# Altium schematic sheet BalEv_ADC_v1_0.SchDoc
size A4; CompanyName: HESSO; Address1: Route du Rawyl 47; Address2: 1950 Sion; Address3: Switzerland; DocumentNumber: 3; SheetNumber: 5; SheetTotal: 8; PageSetup: Record=PageOptions|CenterHorizontal=True|CenterVertical=True|PrintScale=1.00|XCorrection=1.00|YCorrection=1.00|PrintKind=1|BorderSize=5000000|LeftOffset=0|BottomOffset=0|Orientation=2|PaperLength=1000|PaperWidth=1000|Scale=100|PaperSource=15|PrintQuality=1200|MediaType=1|DitherType=10|PrintScaleMode=1|PaperKind=A4|PaperIndex=9; ProjectName: Project Name
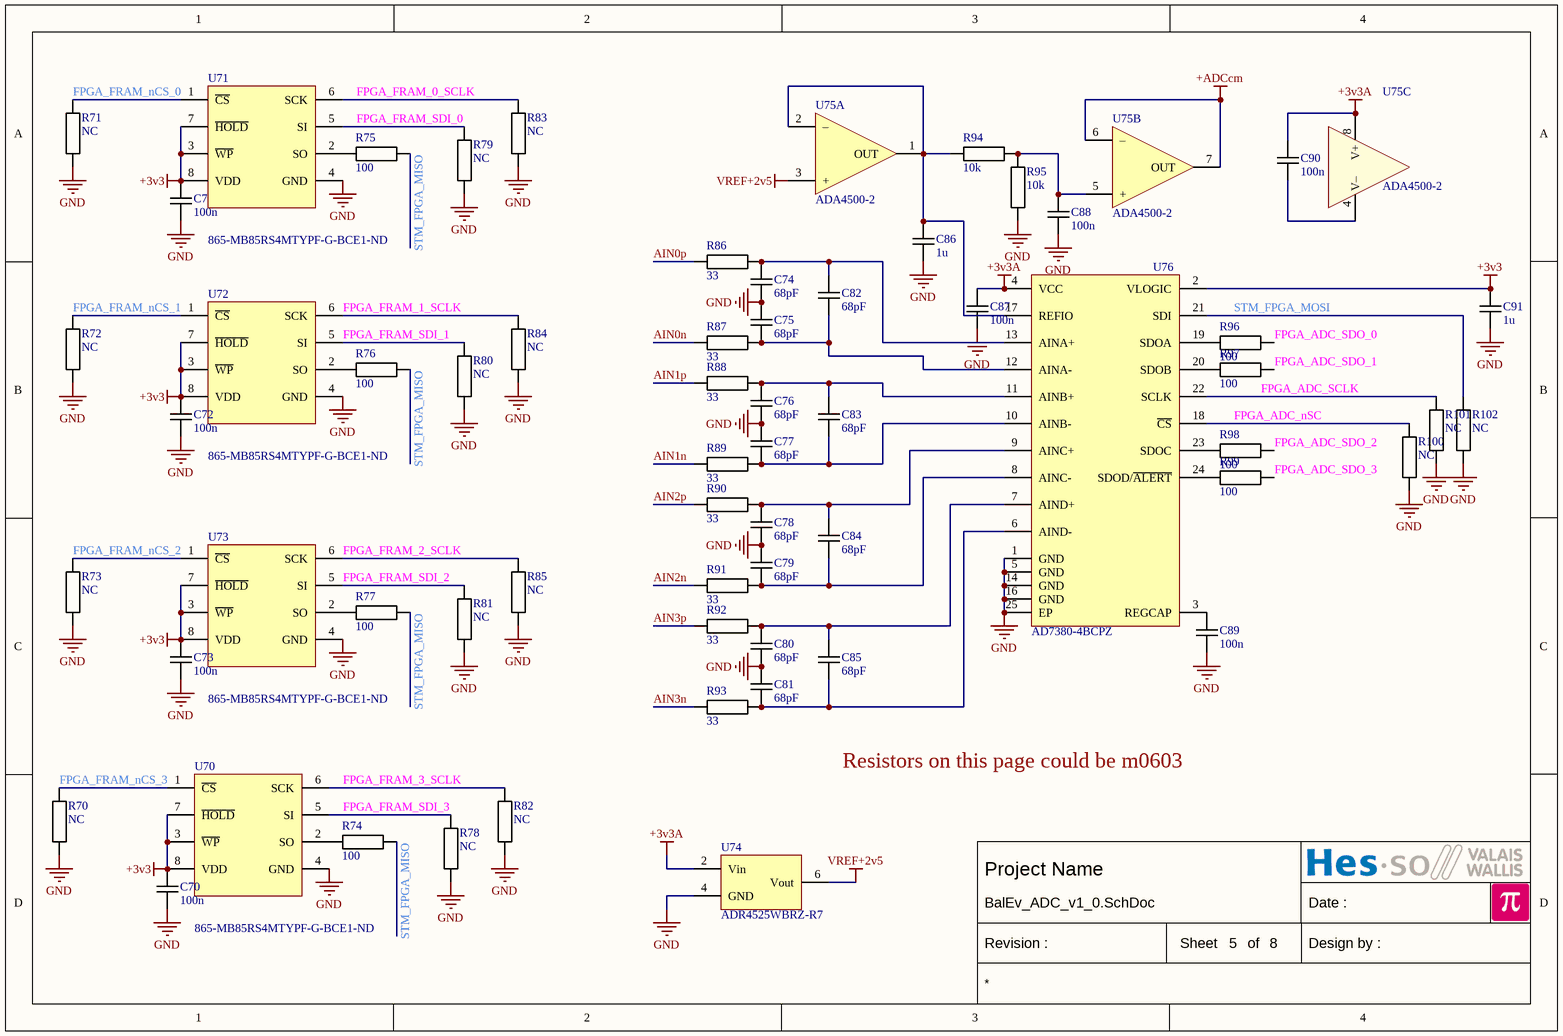
[diagram p0: BalEv_ADC_v1_0.SchDoc]

## Parts
C70  100n  [CAPACITOR 1005 REFLOW]
C71  100n  [CAPACITOR 1005 REFLOW]
C72  100n  [CAPACITOR 1005 REFLOW]
C73  100n  [CAPACITOR 1005 REFLOW]
C74  68pF  [CAPACITOR 1005 REFLOW]
C75  68pF  [CAPACITOR 1005 REFLOW]
C76  68pF  [CAPACITOR 1005 REFLOW]
C77  68pF  [CAPACITOR 1005 REFLOW]
C78  68pF  [CAPACITOR 1005 REFLOW]
C79  68pF  [CAPACITOR 1005 REFLOW]
C80  68pF  [CAPACITOR 1005 REFLOW]
C81  68pF  [CAPACITOR 1005 REFLOW]
C82  68pF  [CAPACITOR 1005 REFLOW]
C83  68pF  [CAPACITOR 1005 REFLOW]
C84  68pF  [CAPACITOR 1005 REFLOW]
C85  68pF  [CAPACITOR 1005 REFLOW]
C86  1u  [CAPACITOR 1005 REFLOW]
C87  100n  [CAPACITOR 1005 REFLOW]
C88  100n  [CAPACITOR 1005 REFLOW]
C89  100n  [CAPACITOR 1005 REFLOW]
C90  100n  [CAPACITOR 1005 REFLOW]
C91  1u  [CAPACITOR 1005 REFLOW]
R70  NC  [RESISTOR 1005 REFLOW]
R71  NC  [RESISTOR 1005 REFLOW]
R72  NC  [RESISTOR 1005 REFLOW]
R73  NC  [RESISTOR 1005 REFLOW]
R74  100  [RESISTOR 1005 REFLOW]
R75  100  [RESISTOR 1005 REFLOW]
R76  100  [RESISTOR 1005 REFLOW]
R77  100  [RESISTOR 1005 REFLOW]
R78  NC  [RESISTOR 1005 REFLOW]
R79  NC  [RESISTOR 1005 REFLOW]
R80  NC  [RESISTOR 1005 REFLOW]
R81  NC  [RESISTOR 1005 REFLOW]
R82  NC  [RESISTOR 1005 REFLOW]
R83  NC  [RESISTOR 1005 REFLOW]
R84  NC  [RESISTOR 1005 REFLOW]
R85  NC  [RESISTOR 1005 REFLOW]
R86  33  [RESISTOR 1005 REFLOW]
R87  33  [RESISTOR 1005 REFLOW]
R88  33  [RESISTOR 1005 REFLOW]
R89  33  [RESISTOR 1005 REFLOW]
R90  33  [RESISTOR 1005 REFLOW]
R91  33  [RESISTOR 1005 REFLOW]
R92  33  [RESISTOR 1005 REFLOW]
R93  33  [RESISTOR 1005 REFLOW]
R94  10k  [RESISTOR 1005 REFLOW]
R95  10k  [RESISTOR 1005 REFLOW]
R96  100  [RESISTOR 1005 REFLOW]
R97  100  [RESISTOR 1005 REFLOW]
R98  100  [RESISTOR 1005 REFLOW]
R99  100  [RESISTOR 1005 REFLOW]
R100  NC  [RESISTOR 1005 REFLOW]
R101  NC  [RESISTOR 1005 REFLOW]
R102  NC  [RESISTOR 1005 REFLOW]
U70  865-MB85RS4MTYPF-G-BCE1-ND  [SO8W P1.27 C5.0X5.0 H2.0]
U71  865-MB85RS4MTYPF-G-BCE1-ND  [SO8W P1.27 C5.0X5.0 H2.0]
U72  865-MB85RS4MTYPF-G-BCE1-ND  [SO8W P1.27 C5.0X5.0 H2.0]
U73  865-MB85RS4MTYPF-G-BCE1-ND  [SO8W P1.27 C5.0X5.0 H2.0]
U74  ADR4525WBRZ-R7  [SO8 P1.27 C4.0X5.0 H1.75]
U75  ADA4500-2  [MSOP8 P0.65 C3.0X3.0 H1.1]  (parts A,B,C of 3)
U76  AD7380-4BCPZ  [QFN24 P0.5 T0.5x0.5 C4.0x4.0 H0.6]

## Nets
+3v3: C70.2 C71.2 C72.2 C73.2 C91.2 U70.3(~{WP}) U70.7(~{HOLD}) U70.8(VDD) U71.3(~{WP}) U71.7(~{HOLD}) U71.8(VDD) U72.3(~{WP}) U72.7(~{HOLD}) U72.8(VDD) U73.3(~{WP}) U73.7(~{HOLD}) U73.8(VDD) U76.2(VLOGIC)
+3v3A: C87.2 C90.2 U74.2(Vin) U75.8(V+) U76.4(VCC)
+ADCcm: U75.6(–) U75.7(OUT)
GND: C70.1 C71.1 C72.1 C73.1 C74.2 C75.1 C76.2 C77.1 C78.2 C79.1 C80.2 C81.1 C86.1 C87.1 C88.1 C89.1 C91.1 R70.1 R71.1 R72.1 R73.1 R78.1 R79.1 R80.1 R81.1 R82.1 R83.1 R84.1 R85.1 R95.1 R100.1 R101.1 R102.1 U70.4(GND) U71.4(GND) U72.4(GND) U73.4(GND) U74.4(GND) U76.1(GND) U76.5(GND) U76.14(GND) U76.16(GND) U76.25(EP)
VREF+2v5: U74.6(Vout) U75.3(+)
AIN0n: R87.1
AIN0p: R86.1
AIN1n: R89.1
AIN1p: R88.1
AIN2n: R91.1
AIN2p: R90.1
AIN3n: R93.1
AIN3p: R92.1
FPGA_ADC_nSC: R100.2 U76.18(~{CS})
FPGA_ADC_SCLK: R101.2 U76.22(SCLK)
FPGA_ADC_SDO_0: R96.2
FPGA_ADC_SDO_1: R97.2
FPGA_ADC_SDO_2: R98.2
FPGA_ADC_SDO_3: R99.2
FPGA_FRAM_0_SCLK: R83.2 U71.6(SCK)
FPGA_FRAM_1_SCLK: R84.2 U72.6(SCK)
FPGA_FRAM_2_SCLK: R85.2 U73.6(SCK)
FPGA_FRAM_3_SCLK: R82.2 U70.6(SCK)
FPGA_FRAM_nCS_0: R71.2 U71.1(~{CS})
FPGA_FRAM_nCS_1: R72.2 U72.1(~{CS})
FPGA_FRAM_nCS_2: R73.2 U73.1(~{CS})
FPGA_FRAM_nCS_3: R70.2 U70.1(~{CS})
FPGA_FRAM_SDI_0: R79.2 U71.5(SI)
FPGA_FRAM_SDI_1: R80.2 U72.5(SI)
FPGA_FRAM_SDI_2: R81.2 U73.5(SI)
FPGA_FRAM_SDI_3: R78.2 U70.5(SI)
STM_FPGA_MISO: R74.2 R75.2 R76.2 R77.2
STM_FPGA_MOSI: R102.2 U76.21(SDI)
NetC74_1: C74.1 C82.2 R86.2 U76.13(AINA+)
NetC75_2: C75.2 C82.1 R87.2 U76.12(AINA-)
NetC76_1: C76.1 C83.2 R88.2 U76.11(AINB+)
NetC77_2: C77.2 C83.1 R89.2 U76.10(AINB-)
NetC78_1: C78.1 C84.2 R90.2 U76.9(AINC+)
NetC79_2: C79.2 C84.1 R91.2 U76.8(AINC-)
NetC80_1: C80.1 C85.2 R92.2 U76.7(AIND+)
NetC81_2: C81.2 C85.1 R93.2 U76.6(AIND-)
NetC86_2: C86.2 R94.1 U75.1(OUT) U75.2(–) U76.17(REFIO)
NetC88_2: C88.2 R94.2 R95.2 U75.5(+)
NetC89_2: C89.2 U76.3(REGCAP)
NetC90_1: C90.1 U75.4(V–)
NetR74_1: R74.1 U70.2(SO)
NetR75_1: R75.1 U71.2(SO)
NetR76_1: R76.1 U72.2(SO)
NetR77_1: R77.1 U73.2(SO)
NetR96_1: R96.1 U76.19(SDOA)
NetR97_1: R97.1 U76.20(SDOB)
NetR98_1: R98.1 U76.23(SDOC)
NetR99_1: R99.1 U76.24(SDOD/~{ALERT})

## Notes on the sheet
- Resistors on this page could be m0603
- Date :
- Revision :
- Sheet
- of
- Design by :

## Library data of the parts
C70-C91 = Capacitor
  C70-C73 C87-C90: Value: 100n
  C74-C85: Value: 68pF
  C86 C91: Value: 1u
R70-R93 R96-R102 = Resistor
  R70-R73 R78-R85 R100-R102: Value: NC
  R74-R77 R96-R99: Value: 100
  R86-R93: Value: 33
R94 R95 = Resistor: Resistor 0.01% (RNCF0603TKW10K0); Value: 10k
U70-U73 = FM25V20A-G: 2-Mbit (256 K × 8) Serial (SPI) F-RAM; Value: 865-MB85RS4MTYPF-G-BCE1-ND
U74 = ADR45___RZ (SOIC8): Ultralow Noise, High Accuracy Voltage References; Value: ADR4525WBRZ-R7
U75 = OPA DUAL: Generic dual OPA 8 pins; Value: ADA4500-2
U76 = AD7380-4BCPZ: Differential Input, Quad, External Reference / Simultaneous Sampling, 16-Bit, SAR ADC; Value: AD7380-4BCPZ